# Altium schematic sheet TEENSY 3-4.SchDoc
size A3; SheetNumber: 1; SheetTotal: 1
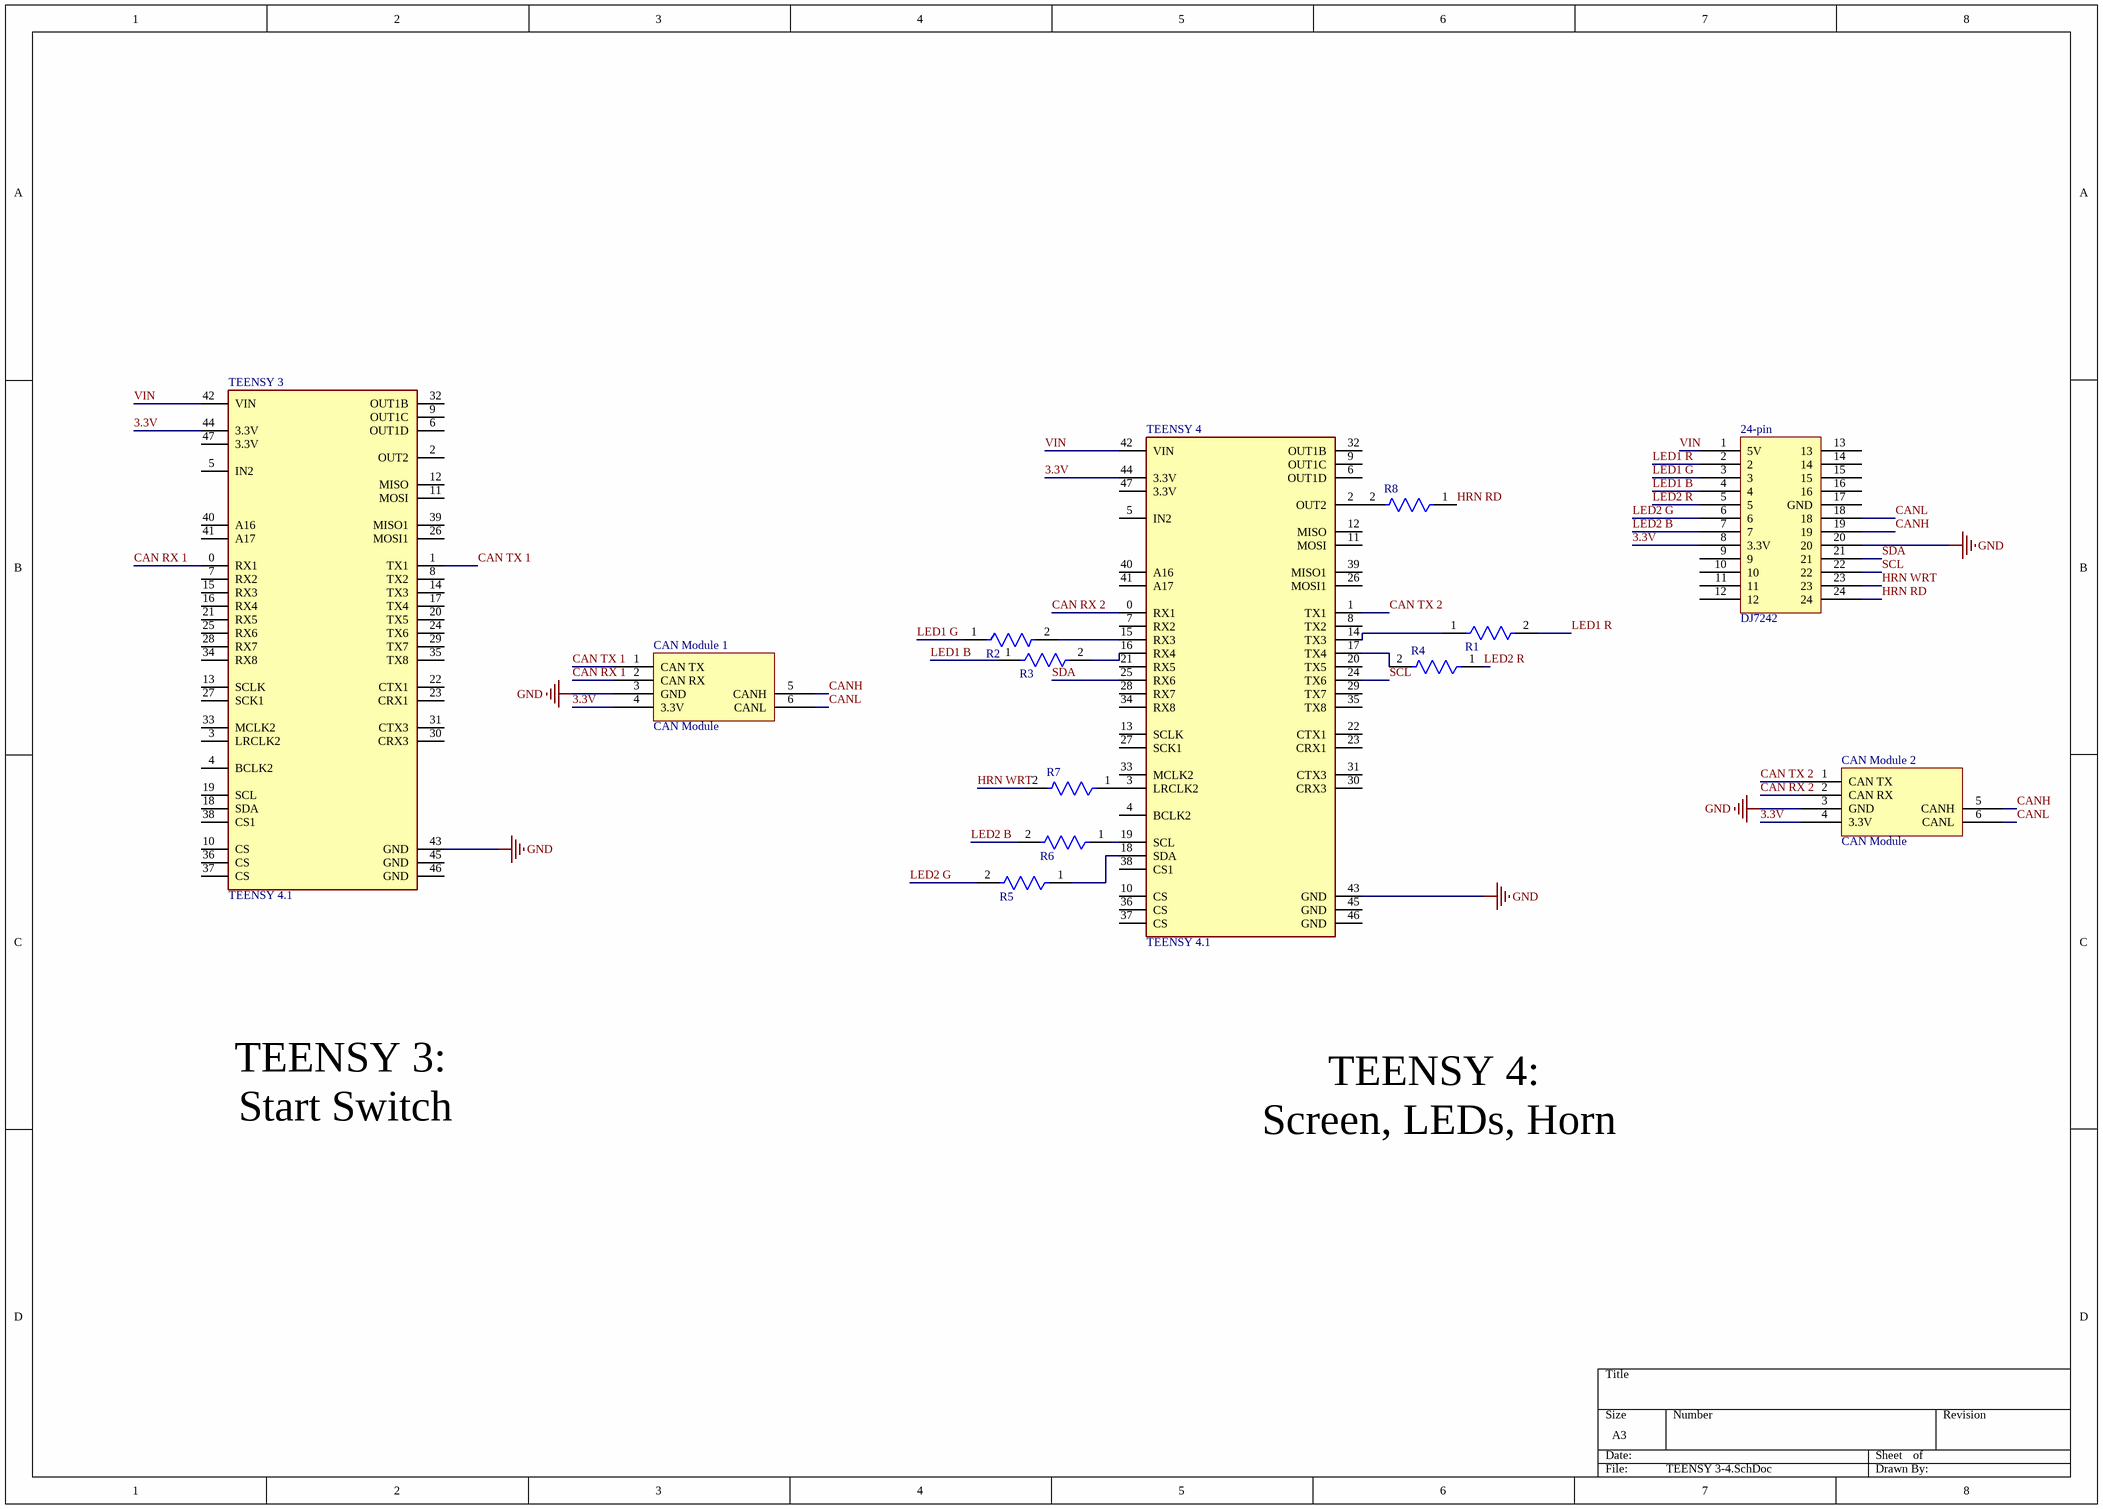
[diagram p0: TEENSY 3-4.SchDoc]

## Parts
24-pin  DJ7242  [DJ7242-Footprint-1]
CAN_Module_1  CAN Module  [CAN Module-Footprint-1]
CAN_Module_2  CAN Module  [CAN Module-Footprint-1]
R1  CMF5073K200FHEB  [FP-CMF50-0]  (value not drawn)
R2  CMF5073K200FHEB  [FP-CMF50-0]  (value not drawn)
R3  CMF5073K200FHEB  [FP-CMF50-0]  (value not drawn)
R4  CMF5073K200FHEB  [FP-CMF50-0]  (value not drawn)
R5  CMF5073K200FHEB  [FP-CMF50-0]  (value not drawn)
R6  CMF5073K200FHEB  [FP-CMF50-0]  (value not drawn)
R7  CMF5073K200FHEB  [FP-CMF50-0]  (value not drawn)
R8  CMF5073K200FHEB  [FP-CMF50-0]  (value not drawn)
TEENSY_3  TEENSY 4.1  [FP-DEV-16996-MFG]
TEENSY_4  TEENSY 4.1  [FP-DEV-16996-MFG]

## Nets
GND: 24-pin.20 CAN_Module_1.3(GND) CAN_Module_2.3(GND) TEENSY_3.43(GND) TEENSY_4.43(GND)
3.3V: 24-pin.8(3.3V) CAN_Module_1.4(3.3V) CAN_Module_2.4(3.3V) TEENSY_3.44(3.3V) TEENSY_4.44(3.3V)
CAN RX 1: CAN_Module_1.2(CAN_RX) TEENSY_3.0(RX1)
CAN RX 2: CAN_Module_2.2(CAN_RX) TEENSY_4.0(RX1)
CAN TX 1: CAN_Module_1.1(CAN_TX) TEENSY_3.1(TX1)
CAN TX 2: CAN_Module_2.1(CAN_TX) TEENSY_4.1(TX1)
CANH: 24-pin.19 CAN_Module_1.5(CANH) CAN_Module_2.5(CANH)
CANL: 24-pin.18 CAN_Module_1.6(CANL) CAN_Module_2.6(CANL)
HRN RD: 24-pin.24 R8.1
HRN WRT: 24-pin.23 R7.2
LED1 B: 24-pin.4 R3.1
LED1 G: 24-pin.3 R2.1
LED1 R: 24-pin.2 R1.2
LED2 B: 24-pin.7 R6.2
LED2 G: 24-pin.6 R5.2
LED2 R: 24-pin.5 R4.1
SCL: 24-pin.22 TEENSY_4.24(TX6)
SDA: 24-pin.21 TEENSY_4.25(RX6)
VIN: 24-pin.1(5V) TEENSY_3.42(VIN) TEENSY_4.42(VIN)
NetR1_1: R1.1 TEENSY_4.14(TX3)
NetR2_2: R2.2 TEENSY_4.15(RX3)
NetR3_2: R3.2 TEENSY_4.16(RX4)
NetR4_2: R4.2 TEENSY_4.17(TX4)
NetR5_1: R5.1 TEENSY_4.18(SDA)
NetR6_1: R6.1 TEENSY_4.19(SCL)
NetR7_1: R7.1 TEENSY_4.3(LRCLK2)
NetR8_2: R8.2 TEENSY_4.2(OUT2)

Not connected (* = marked no-connect by the designer): 24-pin 9 10 11 12 13 14 15 16 17(GND); TEENSY_3 2(OUT2) 3(LRCLK2) 4(BCLK2) 5(IN2) 6(OUT1D) 7(RX2) 8(TX2) 9(OUT1C) 10(CS) 11(MOSI) 12(MISO) 13(SCLK) 14(TX3) 15(RX3) 16(RX4) 17(TX4) 18(SDA) 19(SCL) 20(TX5) 21(RX5) 22(CTX1) 23(CRX1) 24(TX6) 25(RX6) 26(MOSI1) 27(SCK1) 28(RX7) 29(TX7) 30(CRX3) 31(CTX3) 32(OUT1B) 33(MCLK2) 34(RX8) 35(TX8) 36(CS) 37(CS) 38(CS1) 39(MISO1) 40(A16) 41(A17) 45(GND) 46(GND) 47(3.3V); TEENSY_4 4(BCLK2) 5(IN2) 6(OUT1D) 7(RX2) 8(TX2) 9(OUT1C) 10(CS) 11(MOSI) 12(MISO) 13(SCLK) 20(TX5) 21(RX5) 22(CTX1) 23(CRX1) 26(MOSI1) 27(SCK1) 28(RX7) 29(TX7) 30(CRX3) 31(CTX3) 32(OUT1B) 33(MCLK2) 34(RX8) 35(TX8) 36(CS) 37(CS) 38(CS1) 39(MISO1) 40(A16) 41(A17) 45(GND) 46(GND) 47(3.3V)

## Notes on the sheet
- TEENSY 3:
  Start Switch
- TEENSY 4:
  Screen, LEDs, Horn

## Library data of the parts
24-pin = CMP-00030-00002-5: 24-pin connector
CAN_Module_1 CAN_Module_2 = CMP-00030-00003-1: CAN waveshare
R1-R8 = CMP-00030-44386654-1: CMF5073K200FHEB Res Metal Film 73.2K Ohm 1% 0.125W(1/8W) ±50ppm/°C Epoxy AXL T/R; Max Power Dissipation: 250mW; Voltage Rating: 200V; Power Rating: 125mW; Resistance: 73.2kΩ; Tolerance: 1%; Width: 1.65mm; Length: 3.81mm; Schedule B: 8533210090, 8533210090; Termination: Axial; Lead Free: Lead Free; Diameter: 1.65mm; Voltage Rating (DC): 200V; NexarPartId: 44386654; Packaging: Cut Tape; Max Operating Temperature: 175°C; Composition: Metal Film; RoHS: Compliant; Mount: Through Hole; Features: Flame Retardant Coating, Moisture Resistant; Number of Terminations: 2; Temperature Coefficient: 50ppm/°C; Min Operating Temperature: -55°C; Case/Package: Axial
TEENSY_3 TEENSY_4 = CMP-157412-000001-1: TEENSY 4.1 (HEADERS)